# Altium schematic sheet [04] - MICROCONTROLLER.SchDoc: MICROCONTROLLER
size 433 x 279 mm; Author: ZAG; DrawnBy: ZAG; DocumentNumber: 5; SheetNumber: 4; SheetTotal: 8; PageSetup: Record=PageOptions|CenterHorizontal=True|CenterVertical=True|PrintScale=0.96|XCorrection=1.00|YCorrection=1.00|PrintKind=2|BorderSize=5000000|LeftOffset=0|BottomOffset=0|Orientation=2|PaperLength=4318|PaperWidth=2794|Scale=100|PaperSource=15|PrintQuality=600|MediaType=1|DitherType=10|PaperKind=11x17|PrintScaleMode=1; PCBRevision: 01; SchRevision: 01; Project: VAN BATT CTRLR V1; SchStatus: PRELIM
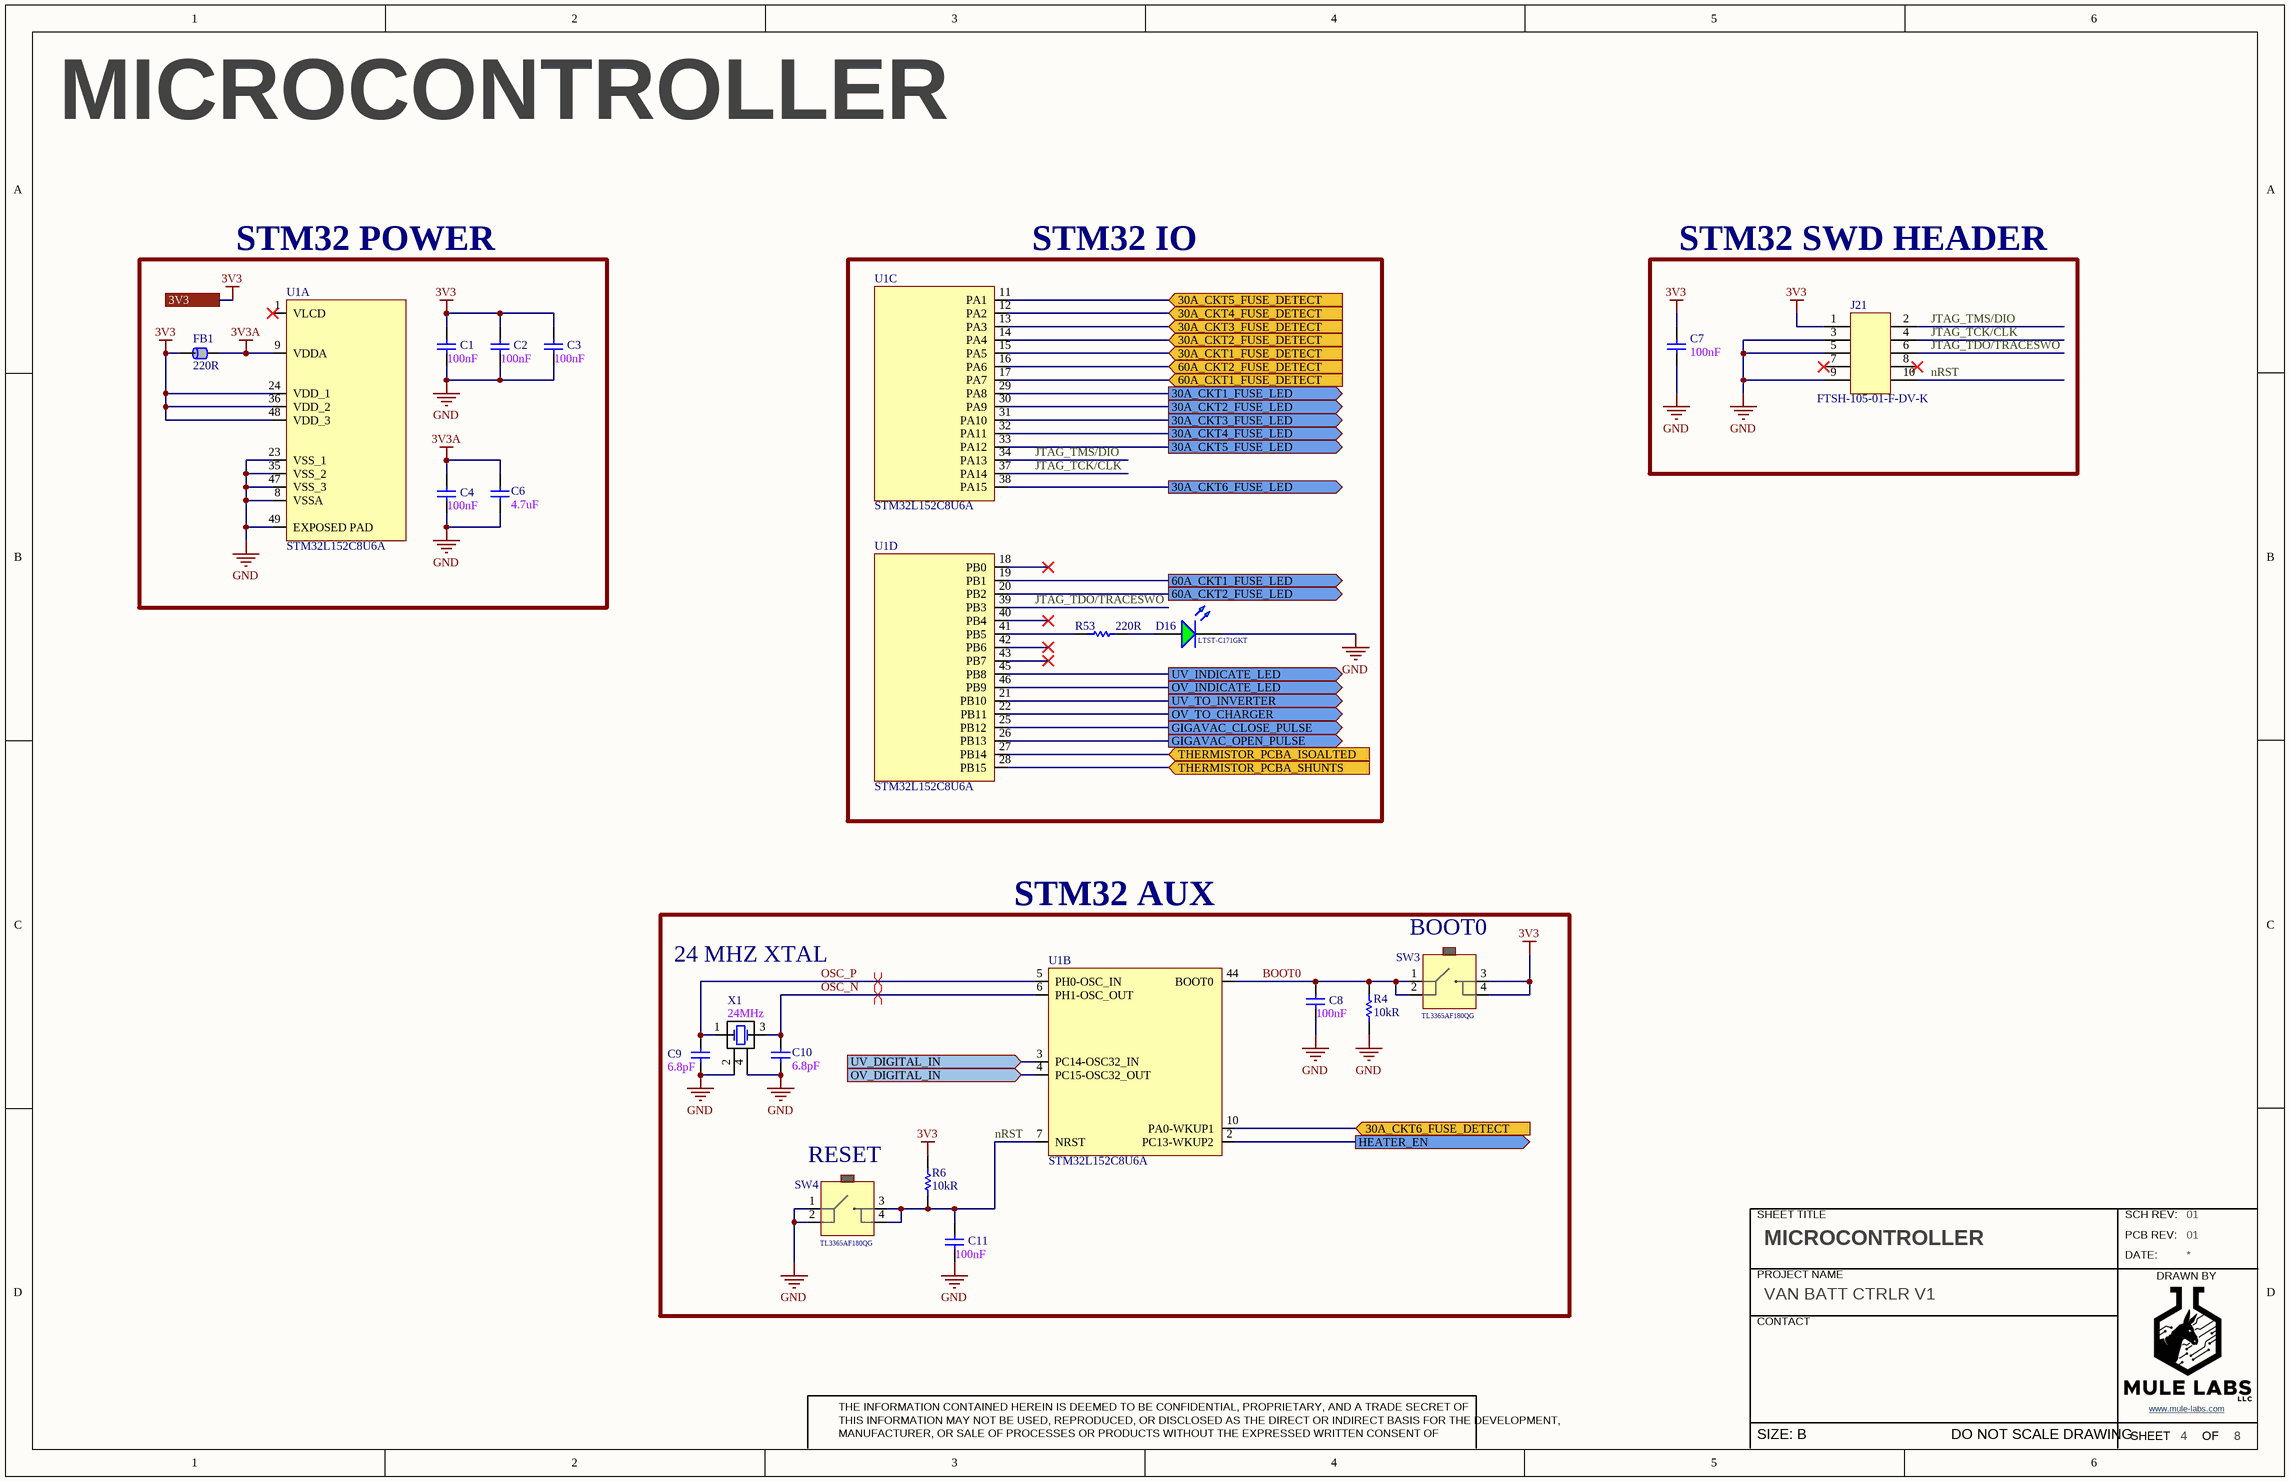
[diagram p0: [04] - MICROCONTROLLER.SchDoc]

## Parts
C1  100nF  [INCH 0603 - METRIC 1608 - H090]
C2  100nF  [INCH 0603 - METRIC 1608 - H090]
C3  100nF  [INCH 0603 - METRIC 1608 - H090]
C4  100nF  [INCH 0603 - METRIC 1608 - H090]
C6  4.7uF  [INCH 0805 - METRIC 2012 - H145]
C7  100nF  [INCH 0603 - METRIC 1608 - H090]
C8  100nF  [INCH 0603 - METRIC 1608 - H090]
C9  6.8pF  [INCH 0402 - METRIC 1005 - H055]
C10  6.8pF  [INCH 0402 - METRIC 1005 - H055]
C11  100nF  [INCH 0603 - METRIC 1608 - H090]
D16  LTST-C171GKT  [LED - 0805 - GREEN]
FB1  220R  [INCH 0603 - METRIC 1608 - H100]
J21  FTSH-105-01-F-DV-K  [SAMTEC_FTSH-105-01-F-DV-K-P-TR]
R4  10kR  [INCH 0603 - METRIC 1508 - H050]
R6  10kR  [INCH 0603 - METRIC 1508 - H050]
R53  220R  [INCH 0603 - METRIC 1608 - H055]
SW3  TL3365AF180QG  [ESWITCH_TL3365AF180QG]
SW4  TL3365AF180QG  [ESWITCH_TL3365AF180QG]
U1  STM32L152C8U6A  [QFN49P50_700X700X60L40X25T560N]  (parts A,B,C,D of 4)
X1  Frequency: 24MHz  [NX2520SA-24MHZ]  (hidden comment: NX2520SA-24.000000MHZ)

## Blocks framed on the sheet
STM32 POWER: C1-C4 C6 FB1 U1
STM32 IO: D16 R53 U1
STM32 SWD HEADER: C7 J21
STM32 AUX: C8-C11 R4 R6 SW3 SW4 U1 X1

## Ports
3V3, 30A_CKT1_FUSE_DETECT (in), 30A_CKT1_FUSE_LED (out), 30A_CKT2_FUSE_DETECT (in), 30A_CKT2_FUSE_LED (out), 30A_CKT3_FUSE_DETECT (in), 30A_CKT3_FUSE_LED (out), 30A_CKT4_FUSE_DETECT (in), 30A_CKT4_FUSE_LED (out), 30A_CKT5_FUSE_DETECT (in), 30A_CKT5_FUSE_LED (out), 30A_CKT6_FUSE_DETECT (in), 30A_CKT6_FUSE_LED (out), 60A_CKT1_FUSE_DETECT (in), 60A_CKT1_FUSE_LED (out), 60A_CKT2_FUSE_DETECT (in), 60A_CKT2_FUSE_LED (out), GIGAVAC_CLOSE_PULSE (out), GIGAVAC_OPEN_PULSE (out), HEATER_EN (out), OV_DIGITAL_IN (in), OV_INDICATE_LED (out), OV_TO_CHARGER (out), THERMISTOR_PCBA_ISOALTED (in), THERMISTOR_PCBA_SHUNTS (in), UV_DIGITAL_IN (in), UV_INDICATE_LED (out), UV_TO_INVERTER (out)

## Nets
3V3: C1.2 C2.2 C3.2 C7.2 FB1.1 J21.1 R6.1 SW3.3 SW3.4 U1.24(VDD_1) U1.36(VDD_2) U1.48(VDD_3) ; port 3V3
3V3A: C4.2 C6.2 FB1.2 U1.9(VDDA)
GND: C1.1 C2.1 C3.1 C4.1 C6.1 C7.1 C8.1 C9.1 C10.1 C11.1 D16.C J21.3 J21.5 J21.9 R4.2 SW4.1 SW4.2 U1.8(VSSA) U1.23(VSS_1) U1.35(VSS_2) U1.47(VSS_3) U1.49(EXPOSED_PAD) X1.2(OSC2) X1.4(OSC2)
30A_CKT1_FUSE_DETECT: U1.15(PA5) ; port 30A_CKT1_FUSE_DETECT
30A_CKT1_FUSE_LED: U1.29(PA8) ; port 30A_CKT1_FUSE_LED
30A_CKT2_FUSE_DETECT: U1.14(PA4) ; port 30A_CKT2_FUSE_DETECT
30A_CKT2_FUSE_LED: U1.30(PA9) ; port 30A_CKT2_FUSE_LED
30A_CKT3_FUSE_DETECT: U1.13(PA3) ; port 30A_CKT3_FUSE_DETECT
30A_CKT3_FUSE_LED: U1.31(PA10) ; port 30A_CKT3_FUSE_LED
30A_CKT4_FUSE_DETECT: U1.12(PA2) ; port 30A_CKT4_FUSE_DETECT
30A_CKT4_FUSE_LED: U1.32(PA11) ; port 30A_CKT4_FUSE_LED
30A_CKT5_FUSE_DETECT: U1.11(PA1) ; port 30A_CKT5_FUSE_DETECT
30A_CKT5_FUSE_LED: U1.33(PA12) ; port 30A_CKT5_FUSE_LED
30A_CKT6_FUSE_DETECT: U1.10(PA0-WKUP1) ; port 30A_CKT6_FUSE_DETECT
30A_CKT6_FUSE_LED: U1.38(PA15) ; port 30A_CKT6_FUSE_LED
60A_CKT1_FUSE_DETECT: U1.17(PA7) ; port 60A_CKT1_FUSE_DETECT
60A_CKT1_FUSE_LED: U1.19(PB1) ; port 60A_CKT1_FUSE_LED
60A_CKT2_FUSE_DETECT: U1.16(PA6) ; port 60A_CKT2_FUSE_DETECT
60A_CKT2_FUSE_LED: U1.20(PB2) ; port 60A_CKT2_FUSE_LED
BOOT0: C8.2 R4.1 SW3.1 SW3.2 U1.44(BOOT0)
GIGAVAC_CLOSE_PULSE: U1.25(PB12) ; port GIGAVAC_CLOSE_PULSE
GIGAVAC_OPEN_PULSE: U1.26(PB13) ; port GIGAVAC_OPEN_PULSE
HEATER_EN: U1.2(PC13-WKUP2) ; port HEATER_EN
JTAG_TCK/CLK: J21.4 U1.37(PA14)
JTAG_TDO/TRACESWO: J21.6 U1.39(PB3)
JTAG_TMS/DIO: J21.2 U1.34(PA13)
nRST: C11.2 J21.10 R6.2 SW4.3 SW4.4 U1.7(NRST)
OSC_N: C10.2 U1.6(PH1-OSC_OUT) X1.3(OSC2)
OSC_P: C9.2 U1.5(PH0-OSC_IN) X1.1(OSC1)
OV_DIGITAL_IN: U1.4(PC15-OSC32_OUT) ; port OV_DIGITAL_IN
OV_INDICATE_LED: U1.46(PB9) ; port OV_INDICATE_LED
OV_TO_CHARGER: U1.22(PB11) ; port OV_TO_CHARGER
THERMISTOR_PCBA_ISOALTED: U1.27(PB14) ; port THERMISTOR_PCBA_ISOALTED
THERMISTOR_PCBA_SHUNTS: U1.28(PB15) ; port THERMISTOR_PCBA_SHUNTS
UV_DIGITAL_IN: U1.3(PC14-OSC32_IN) ; port UV_DIGITAL_IN
UV_INDICATE_LED: U1.45(PB8) ; port UV_INDICATE_LED
UV_TO_INVERTER: U1.21(PB10) ; port UV_TO_INVERTER
NetD16_A: D16.A R53.2
NetR53_1: R53.1 U1.41(PB5)

Not connected (* = marked no-connect by the designer): J21 7* 8*; U1 1(VLCD)* 18(PB0)* 40(PB4)* 42(PB6)* 43(PB7)*

## Layout directives
differential pair: OSC_N, OSC_P

## Notes on the sheet
- 24 MHZ XTAL
- (near SW3) BOOT0
- RESET
- SHEET TITLE
- SCH REV:
- PROJECT NAME
- PCB REV:
- DATE:
- DRAWN BY
- CONTACT
- MANUFACTURER, OR SALE OF PROCESSES OR PRODUCTS WITHOUT THE EXPRESSED WRITTEN CONSENT OF
- THE INFORMATION CONTAINED HEREIN IS DEEMED TO BE CONFIDENTIAL, PROPRIETARY, AND A TRADE SECRET OF
- THIS INFORMATION MAY NOT BE USED, REPRODUCED, OR DISCLOSED AS THE DIRECT OR INDIRECT BASIS FOR THE DEVELOPMENT,
- SHEET
- www.mule-labs.com <http://www.mule-labs.com>
- OF
- SIZE: B
- DO NOT SCALE DRAWING

## Library data of the parts
C1-C4 C7 C8 C11 = CGA3E2X7R1E104K080AA: CAP CER 0.1UF 25V X7R 0603; Manufacturer: TDK; Tolerance: 10%; Supplier 1: Digi-Key; Manufacturer Part Number: CGA3E2X7R1E104K080AA; Stock 1: 40000; Pricing 1: 1=0.1, 10=0.068, 100=0.0304, 500=0.02172, 1000=0.01706 (USD); Mount: Surface Mount; Case/Package: 0603; Weight: 7.1E-05oz; Case Code (Metric): 1608; Case Code (Imperial): 0603; Min Operating Temperature: -55°C; Max Operating Temperature: 125°C; Packaging: Tape and Reel; Capacitance: 100nF; Voltage Rating: 25V; Dielectric: X7R; Termination: SMD/SMT; Package Quantity: 1; Voltage Rating (DC): 25V; Composition: Ceramic; Length: 1.6mm; Height: 0.8mm; Depth: 0.8mm; Width: 0.031inch; Thickness: 0.035inch; Lead Free: Lead Free; REACH SVHC: No SVHC; ComponentLink1URL: https://datasheet.ciiva.com/22725/1735392-22725638.pdf; ComponentLink1Description: https://datasheet.ciiva.com/22725/1735392-22725638.pdf; ComponentLink2URL: https://datasheet.ciiva.com/24220/cga3e2x7r1e104k080aa-265934-24220022.pdf; ComponentLink2Description: https://datasheet.ciiva.com/24220/cga3e2x7r1e104k080aa-265934-24220022.pdf; ComponentLink3URL: https://datasheet.ciiva.com/22725/1735392-22725639.pdf; ComponentLink3Description: https://datasheet.ciiva.com/22725/1735392-22725639.pdf; ComponentLink4URL: https://datasheet.ciiva.com/16427/mlccspec-automotive-general-midvoltage-en-16427320.pdf; ComponentLink4Description: https://datasheet.ciiva.com/16427/mlccspec-automotive-general-midvoltage-en-16427320.pdf; ComponentLink5URL: https://datasheet.ciiva.com/23803/1735392-23803082.pdf; ComponentLink5Description: https://datasheet.ciiva.com/23803/1735392-23803082.pdf; Supplier Part Number 1: 445-5667-1-ND; Category: Capacitor
C6 = GRM21BC71H475KE11L: CAP CER 4.7UF 50V X7S 0805; Manufacturer: Murata; Tolerance: 10%; Supplier 1: Digi-Key; Manufacturer Part Number: GRM21BC71H475KE11L; Stock 1: 30000; Pricing 1: 1=0.61, 10=0.424, 100=0.2544, 500=0.19082, 1000=0.16114 (USD); Mount: Surface Mount; Case/Package: 0805; Weight: 0.000335oz; Case Code (Metric): 2012; Case Code (Imperial): 0805; Min Operating Temperature: -55°C; Max Operating Temperature: 125°C; Capacitance: 4.7uF; Dielectric: X7S; Voltage Rating (DC): 50V; Packaging: Tape and Reel; Voltage Rating: 50V; Termination: SMD/SMT; Composition: Ceramic; Package Quantity: 3000; Length: 0.079inch; Height: 1.25mm; Width: 1.25mm; Thickness: 0.057inch; ComponentLink1URL: http://www.mouser.com/ds/2/281/c02e-2905.pdf; ComponentLink1Description: http://www.mouser.com/ds/2/281/c02e-2905.pdf; ComponentLink2URL: http://search.murata.co.jp/Ceramy/image/img/A01X/partnumbering_e_01.pdf; ComponentLink2Description: http://search.murata.co.jp/Ceramy/image/img/A01X/partnumbering_e_01.pdf; ComponentLink3URL: http://search.murata.co.jp/Ceramy/image/img/A01X/G101/ENG/GRM21BC71H475KE11-01.pdf; ComponentLink3Description: http://search.murata.co.jp/Ceramy/image/img/A01X/G101/ENG/GRM21BC71H475KE11-01.pdf; Supplier Part Number 1: 490-12757-1-ND; Category: Capacitor
C9 C10 = GJM1555C1H6R8WB01D: CAP CER 6.8PF 50V 0402; Manufacturer: Murata; Dielectric: C0G; Supplier 1: Digi-Key; Manufacturer Part Number: GJM1555C1H6R8WB01D; RoHS: Yes; Category: Ceramic Capacitors; Stock 1: 3053; Pricing 1: 1=0.27000, 10=0.18500, 50=0.12360, 100=0.10510, 500=0.07418, 1000=0.06491, 2500=0.06182, 5000=0.05718 (USD); Capacitance: 6.8pF; Voltage Rating (DC): 50V; Length: 1mm; Width: 500um; Thickness: 500um; RoHS Compliant: Yes; ComponentLink1URL: https://search.murata.co.jp/Ceramy/image/img/A01X/G101/ENG/GJM1555C1H6R8WB01-01.pdf?src-supplier=Digi-Key; ComponentLink1Description: https://search.murata.co.jp/Ceramy/image/img/A01X/G101/ENG/GJM1555C1H6R8WB01-01.pdf?src-supplier=Digi-Key; ComponentLink2URL: http://search.murata.co.jp/Ceramy/image/img/A01X/G101/ENG/GJM1555C1H6R8WB01-01.pdf?src-supplier=Digi-Key; ComponentLink2Description: http://search.murata.co.jp/Ceramy/image/img/A01X/G101/ENG/GJM1555C1H6R8WB01-01.pdf?src-supplier=Digi-Key; Supplier Part Number 1: 490-14447-1-ND
D16 = LTST-C171GKT: Lite-On LTST-C171GKT, CHIPLED 0805 Series Green LED, 569 nm 2012 (0805), Rectangle Lens SMD package; Manufacturer: Vishay Lite-On; Lens Colour: Clear,Colorless; Viewing Angle: 130°; Lens Style: Clear,Diffused,Colorless,Rectangular; Luminous Intensity: 12mcd; Forward Current: 30mA; Forward Voltage: 2.1V; Power Rating: 100mW; Dominant Wavelength: 569nm; Test Current: 10mA; Lens Transparency: Clear; Number of Elements: 1; Wavelength: 585nm; Reverse Voltage: 5V; Supplier 1: Digi-Key; Manufacturer Part Number: LTST-C171GKT; Stock 1: 271428; Pricing 1: 1=0.29, 10=0.211, 25=0.1556, 100=0.1111, 250=0.07556, 500=0.06666, 1000=0.05222 (USD); Mount: Surface Mount; Case/Package: 0805; Number of Pins: 2; Color: Green; Case Code (Metric): 2012; Case Code (Imperial): 0805; Min Operating Temperature: -55°C; Max Operating Temperature: 85°C; Package Quantity: 1; Packaging: Tape and Reel; Illumination Colour: Green; Power Dissipation: 100mW; Number of LEDs: 1; Length: 2mm; Height: 0.8mm; Width: 1.25mm; Depth: 1.25mm; Radiation Hardening: No; Lead Free: Lead Free; ComponentLink1URL: https://datasheet.ciiva.com/2110/ltst-c171gkt-2110000.pdf; ComponentLink1Description: https://datasheet.ciiva.com/2110/ltst-c171gkt-2110000.pdf; ComponentLink2URL: https://datasheet.ciiva.com/2110/ltst-c171gkt-2110001.pdf; ComponentLink2Description: https://datasheet.ciiva.com/2110/ltst-c171gkt-2110001.pdf; ComponentLink3URL: https://datasheet.ciiva.com/2110/ltst-c171gkt-2110002.pdf; ComponentLink3Description: https://datasheet.ciiva.com/2110/ltst-c171gkt-2110002.pdf; ComponentLink4URL: https://datasheet.ciiva.com/16396/ltst-c171gkt-16396549.pdf; ComponentLink4Description: https://datasheet.ciiva.com/16396/ltst-c171gkt-16396549.pdf; ComponentLink5URL: https://datasheet.ciiva.com/11773/0900766b80dc0296-11773991.pdf; ComponentLink5Description: https://datasheet.ciiva.com/11773/0900766b80dc0296-11773991.pdf; ComponentLink6URL: https://datasheet.ciiva.com/12400/lite-on-ltst-c171gkt-190133-12400647.pdf; ComponentLink6Description: https://datasheet.ciiva.com/12400/lite-on-ltst-c171gkt-190133-12400647.pdf; Supplier Part Number 1: 160-1423-1-ND; Category: LED
FB1 = BLM18EG221SN1D: FERRITE BEAD 220 OHM 0603 1LN; Manufacturer: Murata; Material: Steel,Ferrite; Tolerance: 25%; DC Resistance (DCR): 50mR; Max DC Current: 2A; Number of Lines: 1; Test Frequency: 100MHz; Supplier 1: Digi-Key; Manufacturer Part Number: BLM18EG221SN1D; Stock 1: 66132; Pricing 1: 1=0.23, 10=0.175, 25=0.1452, 50=0.1252, 100=0.1126, 250=0.09508, 500=0.08508, 1000=0.07257 (USD); Case/Package: 0603; Number of Pins: 2; Core Material: Ferrite; Case Code (Metric): 1608; Case Code (Imperial): 0603; Contact Plating: Tin,Matte; Min Operating Temperature: -55°C; Max Operating Temperature: 125°C; Impedance: 220R; Resistance: 50mR; Package Quantity: 1; Packaging: Tape and Reel; Current Rating: 2A; Max Current Rating: 2A; Termination: SMD/SMT; DC Current: 2A; Military Standard: Not; Frequency: 100MHz; Number of Circuits: 1; Length: 1.6mm; Height: 0.8mm; Width: 0.8mm; Depth: 0.8mm; Radiation Hardening: No; REACH SVHC: No SVHC; Lead Free: Lead Free; ComponentLink1URL: https://datasheet.ciiva.com/11799/0900766b811b5866-11799010.pdf; ComponentLink1Description: https://datasheet.ciiva.com/11799/0900766b811b5866-11799010.pdf; ComponentLink2URL: https://datasheet.ciiva.com/1467/5169-1467157.pdf; ComponentLink2Description: https://datasheet.ciiva.com/1467/5169-1467157.pdf; ComponentLink3URL: https://datasheet.ciiva.com/1467/5169-1467158.pdf; ComponentLink3Description: https://datasheet.ciiva.com/1467/5169-1467158.pdf; ComponentLink4URL: https://datasheet.ciiva.com/1012/l0110s0101blm18e-1012872.pdf; ComponentLink4Description: https://datasheet.ciiva.com/1012/l0110s0101blm18e-1012872.pdf; ComponentLink5URL: https://datasheet.ciiva.com/1012/l0110s0101blm18e-1012873.pdf; ComponentLink5Description: https://datasheet.ciiva.com/1012/l0110s0101blm18e-1012873.pdf; ComponentLink6URL: https://datasheet.ciiva.com/1012/l0110s0101blm18e-1012874.pdf; ComponentLink6Description: https://datasheet.ciiva.com/1012/l0110s0101blm18e-1012874.pdf; ComponentLink7URL: https://datasheet.ciiva.com/8510/l0110s0101blm18e-8510140.pdf; ComponentLink7Description: https://datasheet.ciiva.com/8510/l0110s0101blm18e-8510140.pdf; ComponentLink8URL: https://datasheet.ciiva.com/14122/blm-series-eng-tds-14122908.pdf; ComponentLink8Description: https://datasheet.ciiva.com/14122/blm-series-eng-tds-14122908.pdf; ComponentLink9URL: https://datasheet.ciiva.com/16419/l0110s0101blm18e-16419148.pdf; ComponentLink9Description: https://datasheet.ciiva.com/16419/l0110s0101blm18e-16419148.pdf; ComponentLink10URL: https://datasheet.ciiva.com/17246/l0110s0101blm18e-17246927.pdf; ComponentLink10Description: https://datasheet.ciiva.com/17246/l0110s0101blm18e-17246927.pdf; ComponentLink11URL: https://datasheet.ciiva.com/41449/001171699-da-01-en-chip-drossel0603-220r-2000ma-1-6x0-8mm-41449376.pdf; ComponentLink11Description: https://datasheet.ciiva.com/41449/001171699-da-01-en-chip-drossel0603-220r-2000ma-1-6x0-8mm-41449376.pdf; ComponentLink12URL: https://datasheet.ciiva.com/41449/001172265-da-01-en-drossel-0603-220r-1-6x0-8mm-4000st-41449579.pdf; ComponentLink12Description: https://datasheet.ciiva.com/41449/001172265-da-01-en-drossel-0603-220r-1-6x0-8mm-4000st-41449579.pdf; Supplier Part Number 1: 490-3992-1-ND; Category: Ferrite Bead
J21 = FTSH-105-01-F-DV-K: 1.27 mm, 2 Rows, 10 Contacts, Surface Mount; Manufacturer: Samtec; Number of Contacts: 10; Connector Type: Male Pin; Max Current Rating: 1.75A; Pitch: 1.27mm; Row Spacing: 0.05inch; Supplier 1: Digi-Key; Manufacturer Part Number: FTSH-105-01-F-DV-K; RoHS: Yes; Category: Headers and Wire Housings; Stock 1: 8408; Pricing 1: 1=2.82000, 10=2.70400, 100=2.25340, 500=1.91538, 1000=1.63370, 5000=1.46470 (USD); Mount: Surface Mount; Contact Plating: Gold; Contact Material: Copper,Bronze; Housing Color: Black; Housing Material: Polymer; Color: Black; Min Operating Temperature: -55°C; Max Operating Temperature: 125°C; Number of Rows: 2; Termination: Solder; Packaging: Rail/Tube; Orientation: Straight; Package Quantity: 1; Number of Positions: 10; Series: FTSH; Contact Type: Male Pin; Length: 15.2mm; Height: 3.3mm; Depth: 3.43mm; Contact Mating Length: 0.12inch; Radiation Hardening: No; Lead Free: Lead Free; RoHS Compliant: Yes; ComponentLink1URL: https://datasheet.ciiva.com/19461/2046846-19461026.pdf?src-supplier=Jameco; ComponentLink1Description: https://datasheet.ciiva.com/19461/2046846-19461026.pdf?src-supplier=Jameco; ComponentLink2URL: https://datasheet.ciiva.com/738/ftsh-1xx-xx-xxx-dv-xxx-mkt-738998.pdf?src-supplier=Digi-Key; ComponentLink2Description: https://datasheet.ciiva.com/738/ftsh-1xx-xx-xxx-dv-xxx-mkt-738998.pdf?src-supplier=Digi-Key; ComponentLink3URL: https://datasheet.ciiva.com/10245/ftsh-mt-10245273.pdf?src-supplier=Avnet; ComponentLink3Description: https://datasheet.ciiva.com/10245/ftsh-mt-10245273.pdf?src-supplier=Avnet; ComponentLink4URL: https://datasheet.ciiva.com/16657/ftsh-mt-16657371.pdf?src-supplier=Avnet+Europe; ComponentLink4Description: https://datasheet.ciiva.com/16657/ftsh-mt-16657371.pdf?src-supplier=Avnet+Europe; ComponentLink5URL: https://datasheet.ciiva.com/15195/getdatasheetpartid-133463-15195260.pdf?src-supplier=Verical; ComponentLink5Description: https://datasheet.ciiva.com/15195/getdatasheetpartid-133463-15195260.pdf?src-supplier=Verical; Supplier Part Number 1: SAM8796-ND
R4 R6 = CRCW060310K0JNEA: RES SMD 10K OHM 5% 1/10W 0603; Manufacturer: Vishay Dale; Temperature Coefficient: 200ppm/°C; Max Power Dissipation: 100mW; Voltage Rating: 75V; Supplier 1: Digi-Key; Manufacturer Part Number: CRCW060310K0JNEA; RoHS: Yes; Category: Chip SMD Resistors; Stock 1: 5423; Pricing 1: 1=0.10000, 10=0.03100, 100=0.01250, 1000=0.00563, 2500=0.00488 (USD); Mount: Surface Mount; Case/Package: 0603; Number of Pins: 2; Case Code (Metric): 1608; Case Code (Imperial): 0603; Contact Plating: Tin; Weight: 7.1E-05oz; Size Code: 0603; Min Operating Temperature: -55°C; Max Operating Temperature: 155°C; Resistance: 10kR; Tolerance: 5%; Resistor Type: Thick Film; Packaging: Tape and Reel; Number of Terminations: 2; Package Quantity: 1; Power Rating: 100mW; Termination: SMD/SMT; Features: Automotive AEC-Q200; Voltage Rating (DC): 75V; Series: CRCW; Construction: Rectangular; Resistance Tolerance: 5%; Length: 1.55mm; Width: 0.033inch; Height: 0.02inch; Depth: 0.85mm; Radiation Hardening: No; Lead Free: Lead Free; RoHS Compliant: Yes; REACH SVHC: Unknown; Military Standard: Not; ComponentLink1URL: https://datasheet.ciiva.com/2461/dcrcwe3-2461971.pdf?src-supplier=Digi-Key; ComponentLink1Description: https://datasheet.ciiva.com/2461/dcrcwe3-2461971.pdf?src-supplier=Digi-Key; ComponentLink2URL: https://datasheet.ciiva.com/2461/dcrcwe3-2461972.pdf?src-supplier=Digi-Key; ComponentLink2Description: https://datasheet.ciiva.com/2461/dcrcwe3-2461972.pdf?src-supplier=Digi-Key; ComponentLink3URL: https://datasheet.ciiva.com/2461/dcrcwe3-2461973.pdf?src-supplier=Digi-Key; ComponentLink3Description: https://datasheet.ciiva.com/2461/dcrcwe3-2461973.pdf?src-supplier=Digi-Key; ComponentLink4URL: https://datasheet.ciiva.com/16343/dcrcwe3-16343525.pdf?src-supplier=Future+Electronics; ComponentLink4Description: https://datasheet.ciiva.com/16343/dcrcwe3-16343525.pdf?src-supplier=Future+Electronics; ComponentLink5URL: https://datasheet.ciiva.com/16755/70201119-16755717.pdf?src-supplier=Allied+Electronics; ComponentLink5Description: https://datasheet.ciiva.com/16755/70201119-16755717.pdf?src-supplier=Allied+Electronics; ComponentLink6URL: https://datasheet.ciiva.com/16771/70201119-16771051.pdf?src-supplier=Allied+Electronics; ComponentLink6Description: https://datasheet.ciiva.com/16771/70201119-16771051.pdf?src-supplier=Allied+Electronics; ComponentLink7URL: https://datasheet.ciiva.com/16515/dcrcwe3-16515020.pdf?src-supplier=Avnet+Asia; ComponentLink7Description: https://datasheet.ciiva.com/16515/dcrcwe3-16515020.pdf?src-supplier=Avnet+Asia; ComponentLink8URL: https://datasheet.ciiva.com/3256/dcrcwe3-3256942.pdf?src-supplier=Avnet; ComponentLink8Description: https://datasheet.ciiva.com/3256/dcrcwe3-3256942.pdf?src-supplier=Avnet; ComponentLink9URL: https://datasheet.ciiva.com/3256/dcrcwe3-3256943.pdf?src-supplier=Avnet; ComponentLink9Description: https://datasheet.ciiva.com/3256/dcrcwe3-3256943.pdf?src-supplier=Avnet; Supplier Part Number 1: 541-10KGCT-ND
R53 = RC0603FR-07220RL: RES SMD 220 OHM 1% 1/10W 0603; Manufacturer: Yageo; Temperature Coefficient: 100ppm/°C; Voltage Rating (DC): 50V; Power Rating: 100mW; Supplier 1: Digi-Key; Manufacturer Part Number: RC0603FR-07220RL; Stock 1: 8341820; Case/Package: 0603; Number of Pins: 2; Case Code (Imperial): 0603; Case Code (Metric): 1608; Min Operating Temperature: -55°C; Max Operating Temperature: 155°C; Resistance: 220R; Tolerance: 1%; Packaging: Tape and Reel; Composition: Thick Film; Voltage Rating: 50V; Package Quantity: 1; Termination: SMD/SMT; Number of Terminations: 2; Military Standard: Not; Max Power Dissipation: 100mW; Features: Moisture Resistant; Length: 1.6mm; Height: 0.022inch; Width: 0.031inch; Depth: 0.8mm; REACH SVHC: No SVHC; Lead Free: Lead Free; ComponentLink1URL: http://www.yageo.com/documents/recent/PYu-RC_Group_51_RoHS_L_9.pdf; ComponentLink1Description: http://www.yageo.com/documents/recent/PYu-RC_Group_51_RoHS_L_9.pdf; ComponentLink2URL: http://documents.rs-components.com/techlib://itc_doclist_GB.htm?stockno=5050303; ComponentLink2Description: http://documents.rs-components.com/techlib://itc_doclist_GB.htm?stockno=5050303; ComponentLink3URL: http://www.farnell.com/datasheets/1738695.pdf; ComponentLink3Description: http://www.farnell.com/datasheets/1738695.pdf; Supplier Part Number 1: 311-220HRCT-ND
SW3 SW4 = TL3365AF180QG: SWITCH TACTILE SPST-NO 0.05A 12V; Manufacturer: E-Switch; Mechanical Life: 100000Cycles; Illumination Type: Non-Illuminated; Operating Force: 180gf; Throw Configuration: SPST; Switch Travel: 0.2mm; Switch Function: Off-Mom; Supplier 1: Digi-Key; Manufacturer Part Number: TL3365AF180QG; Stock 1: 55347; Pricing 1: 1=0.34, 10=0.333, 25=0.3208, 50=0.3088, 100=0.297, 250=0.27324, 500=0.2376, 1000=0.20196 (USD); Mount: Surface Mount; Min Operating Temperature: -20°C; Max Operating Temperature: 70°C; Packaging: Tape and Reel; Termination: Gull Wing; Lead Free: Lead Free; Supplier Part Number 1: EG5384CT-ND
U1 = STM32L152C8U6A: IC MCU 32BIT 64KB FLASH 48UFQFPN; Manufacturer: STMicroelectronics; RAM Size: 32KB; Max Power Dissipation: 606mW; Interface: I2C,SPI,USB,IrDA,UART,USART,LIN; Number of I/Os: 37; Number of Timers/Counters: 8; Frequency: 32MHz; Oscillator Type: Internal; Data Bus Width: 32b; Min Supply Voltage: 1.65V; Max Supply Voltage: 3.6V; Watchdog Timer: Yes; Peripherals: Brown-out Detect/Reset,POR,PWM,WDT,DMA,LCD; Core Architecture: ARM; Supplier 1: Digi-Key; Supplier Part Number 1: 497-18956-ND; Manufacturer Part Number: STM32L152C8U6A; RoHS: Yes; Category: Microcontrollers; Stock: 316; Pricing: 1=5.17000, 10=4.64000, 25=4.38600, 80=3.80138, 260=3.60638, 520=3.23600, 1040=2.84288 (USD); Case/Package: UFQFPN; Number of Pins: 48; Min Operating Temperature: -40°C; Max Operating Temperature: 85°C; Packaging: Tray; Number of Programmable I/O: 37; Max Frequency: 32MHz; Memory Type: FLASH; Package Quantity: 260; Memory Size: 64KB; REACH SVHC: No SVHC; RoHS Compliant: Yes; ComponentLink1URL: https://datasheet.ciiva.com/48492/dm00078689-48492438.pdf?src-supplier=Avnet; ComponentLink1Description: https://datasheet.ciiva.com/48492/dm00078689-48492438.pdf?src-supplier=Avnet
X1 = NX2520SA-24MHZ: CRYSTAL 24.000000MHZ 10PF SMD; Manufacturer: NDK; Frequency Stability: 10ppm; ESR (Equivalent Series Resistance): 60R; Supplier 1: Digi-Key; Manufacturer Part Number: NX2520SA-24.000000MHZ; RoHS: Yes; Category: Crystals; Stock 1: 6806; Pricing 1: 1=1.18000, 10=1.12700, 50=1.10040, 100=0.94320, 500=0.91700, 1000=0.77290 (USD); Mount: Surface Mount; Case/Package: SMD/SMT; Min Operating Temperature: -10°C; Max Operating Temperature: 60°C; Frequency Tolerance: 10ppm; Load Capacitance: 10pF; Packaging: Tape and Reel; Package Quantity: 3000; Length: 0.098inch; Width: 0.079inch; Height: 0.026inch; Lead Free: Lead Free; ComponentLink1URL: https://datasheet.ciiva.com/857/nx2520sa-857515.pdf?src-supplier=Digi-Key; ComponentLink1Description: https://datasheet.ciiva.com/857/nx2520sa-857515.pdf?src-supplier=Digi-Key; ComponentLink2URL: https://datasheet.ciiva.com/857/nx2520sa-857516.pdf?src-supplier=Digi-Key; ComponentLink2Description: https://datasheet.ciiva.com/857/nx2520sa-857516.pdf?src-supplier=Digi-Key; ComponentLink3URL: https://datasheet.ciiva.com/857/nx2520sa-857517.pdf?src-supplier=Digi-Key; ComponentLink3Description: https://datasheet.ciiva.com/857/nx2520sa-857517.pdf?src-supplier=Digi-Key; Supplier Part Number 1: 644-1061-1-ND